# EasyEDA Pro project 蓝牙歌词音箱.epro, schematic Schematic1
Create Date: 2023-08-11; Page Name: P1; Project Name: 蓝牙歌词音箱; Schematic Name: Schematic1; Update Date: 2023-09-09; Company: 花栗鼠; Page Size: A3; Version: V1.1
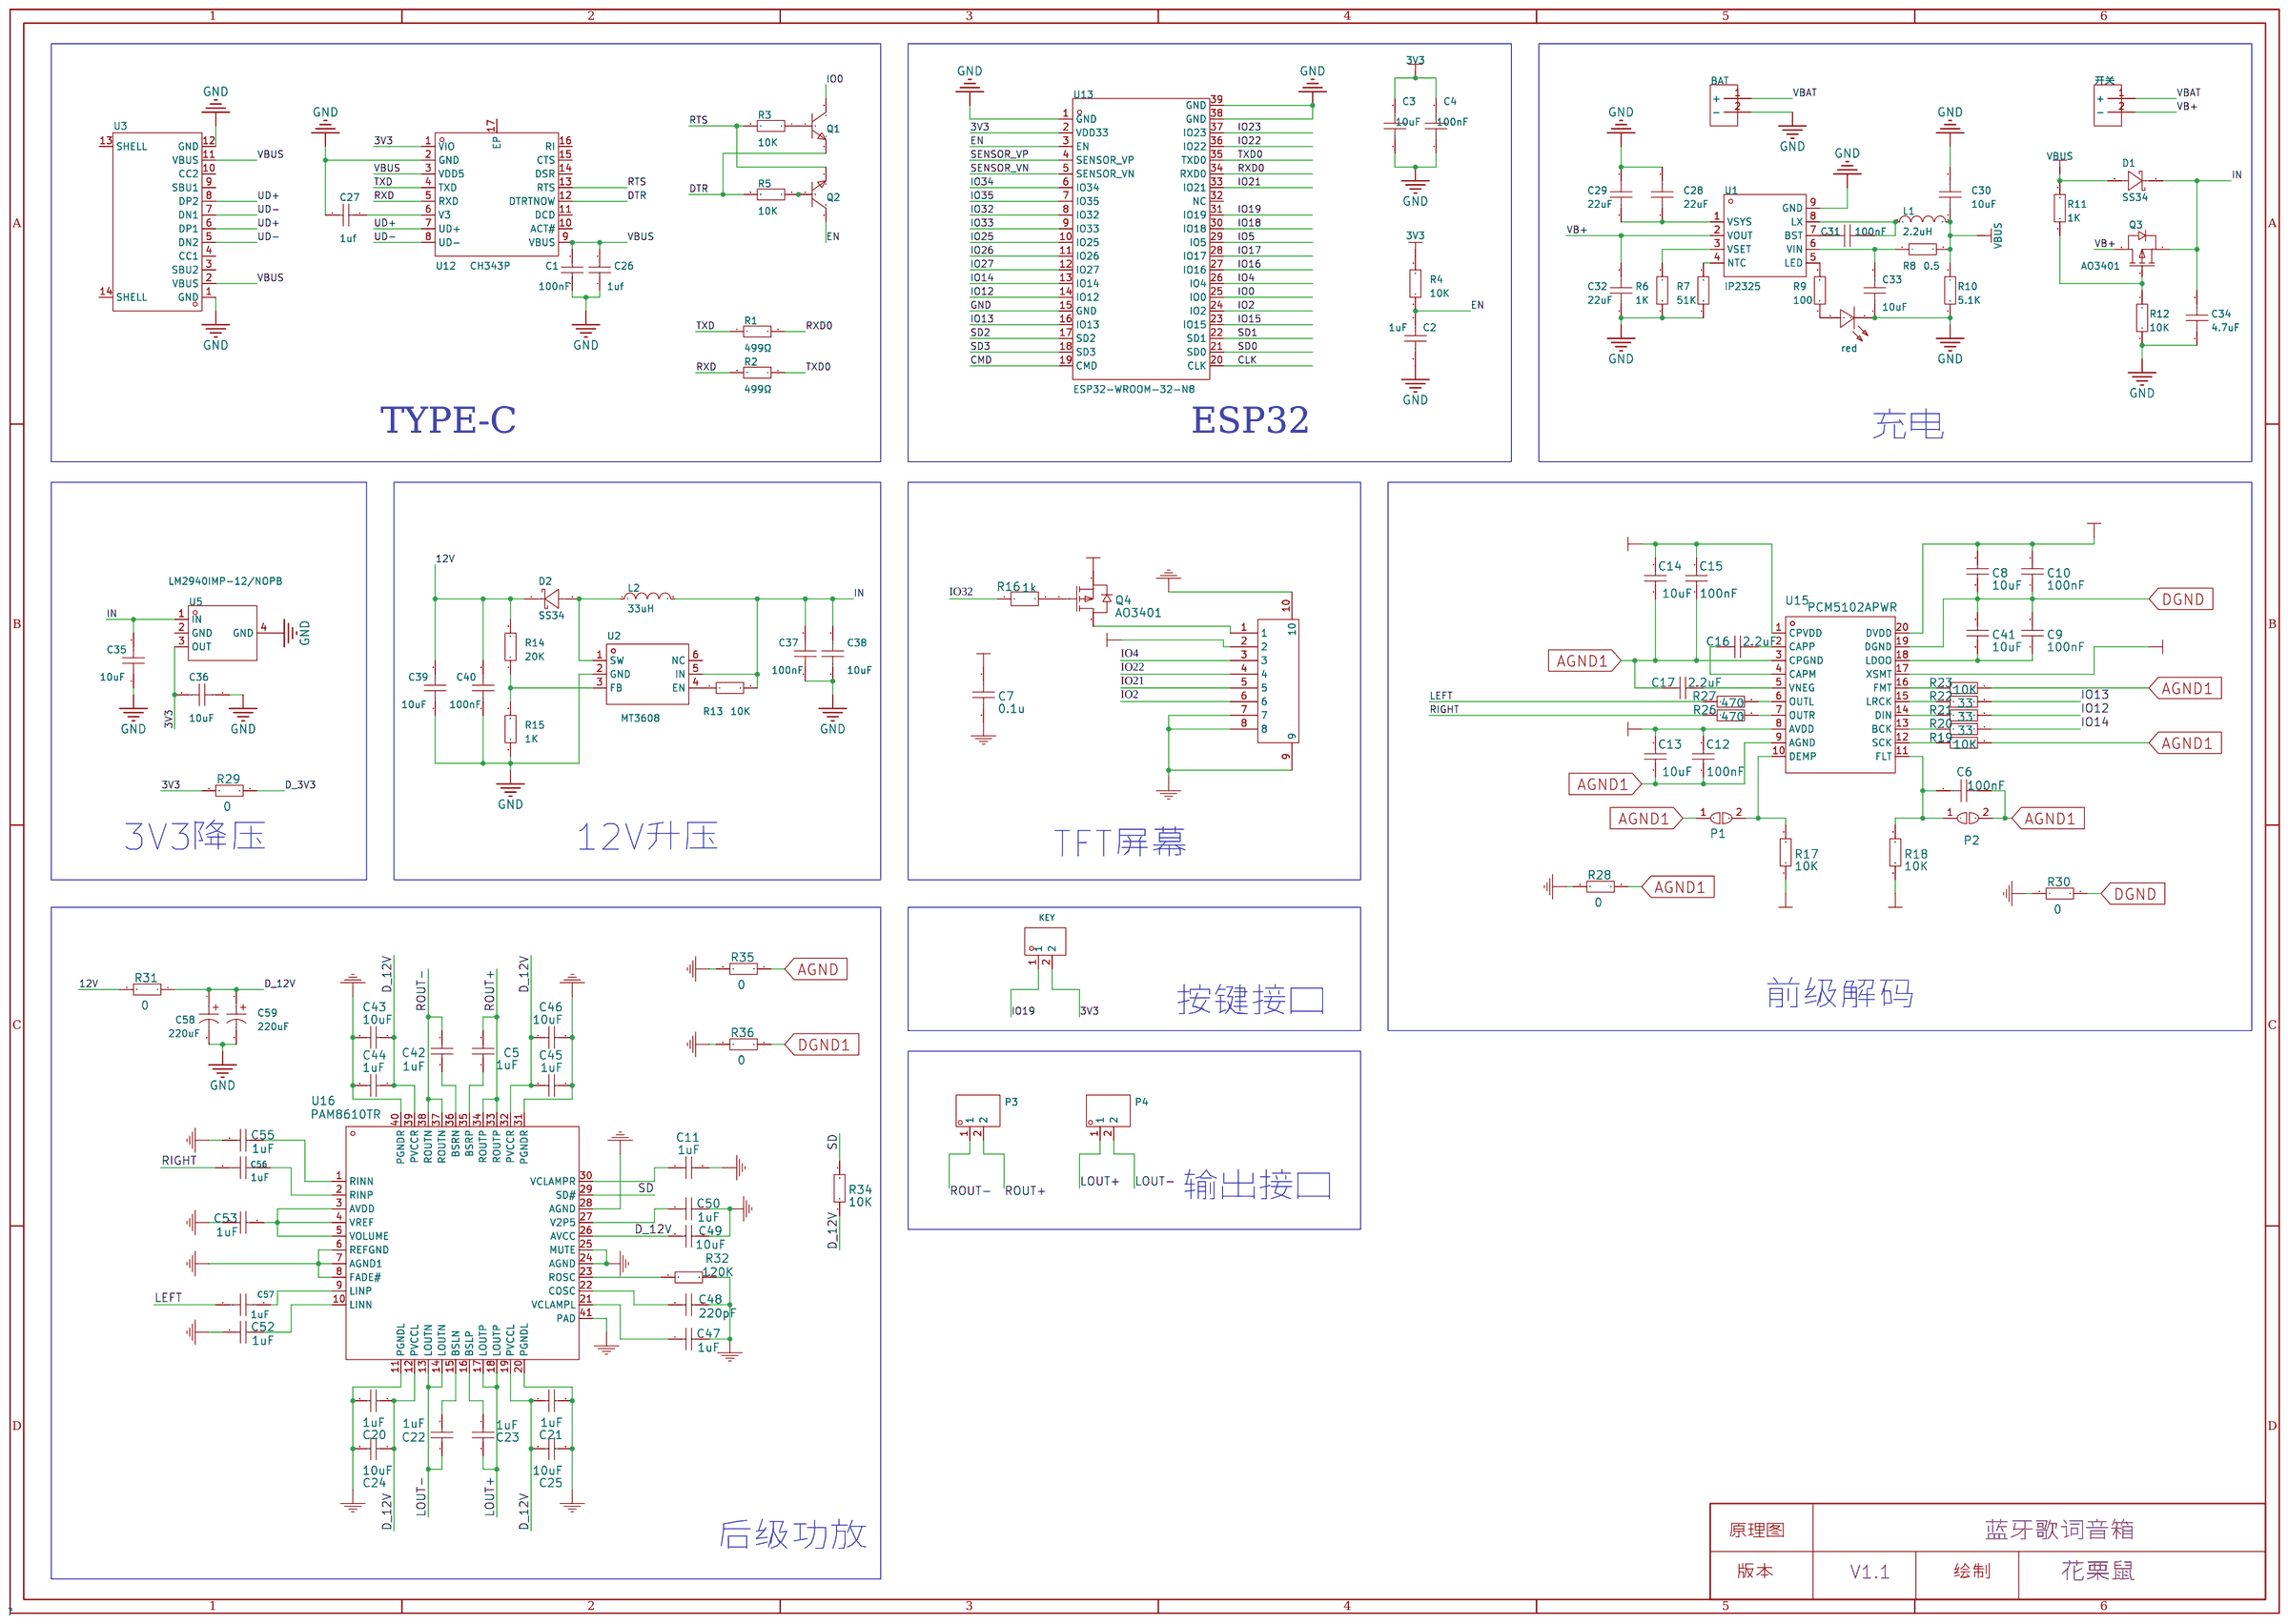
[diagram p1: schematic sheet]

## Parts
BAT  焊盘  [BAT_Plate]
C1  100nF  [C0603]
C2  1uF  [C0603]
C3  10uF  [c0603]
C4  100nF  [c0603]
C5  1uF  [C0603]
C6  100nF  [C0603]
C7  0.1u  [C0603]
C8  10uF  [C0603]
C9  100nF  [C0603]
C10  100nF  [C0603]
C11  1uF  [C0603]
C12  100nF  [C0603]
C13  10uF  [C0603]
C14  10uF  [C0603]
C15  100nF  [C0603]
C16  2.2uF  [C0603]
C17  2.2uF  [C0603]
C20  1uF  [C0603]
C21  1uF  [C0603]
C22  1uF  [C0603]
C23  1uF  [C0603]
C24  10uF  [C0603]
C25  10uF  [C0603]
C26  1uf  [C0603]
C27  1uf  [C0603]
C28  22uF  [C0603]
C29  22uF  [C0603]
C30  10uF  [C0603]
C31  100nF  [C0603]
C32  22uF  [C0603]
C33  10uF  [C0603]
C34  4.7uF  [C0603]
C35  10uF  [C0603]
C36  10uF  [C0603]
C37  100nF  [C0603]
C38  10uF  [C0603]
C39  10uF  [C0603]
C40  100nF  [C0603]
C41  10uF  [C0603]
C42  1uF  [C0603]
C43  10uF  [C0603]
C44  1uF  [C0603]
C45  1uF  [C0603]
C46  10uF  [C0603]
C47  1uF  [C0603]
C48  220pF  [C0603]
C49  10uF  [C0603]
C50  1uF  [C0603]
C52  1uF  [C0603]
C53  1uF  [C0603]
C55  1uF  [C0603]
C56  1uF  [CAP-TH_L7.2-W5.0-P5.00-D1.0]
C57  1uF  [CAP-TH_L7.2-W5.0-P5.00-D1.0]
C58  220uF  [CAP-TH_BD10.0-P5.00-D0.6-FD]
C59  220uF  [CAP-TH_BD10.0-P5.00-D0.6-FD]
D1  SS34  [SMA_L4.3-W2.5-LS5.0-RD]
D2  SS34  [SMA_L4.3-W2.5-LS5.0-RD]
FPC1  AFC01-S08FCA-00  [FPC-SMD_P0.50-8P_FGS-XJ-H2.0]
KEY  PZ254V-11-02P  [HDR-TH_2P-P2.54-V-M]
L1  2.2uH  [IND-SMD_L5.4-W5.2_FXL0530]
L2  33uH  [IND-SMD_L5.4-W5.2_FXL0530]
P1  短接线  [短接焊盘]
P2  短接线  [短接焊盘]
P3  WJ15EDGRC-3.81-2P  [CONN-TH_2P-P3.81_WJ15EDGRC-3.81-2P]
P4  WJ15EDGRC-3.81-2P  [CONN-TH_2P-P3.81_WJ15EDGRC-3.81-2P]
Q1  SS8050-H  [SOT-23-3_L2.9-W1.3-P1.90-LS2.4-BR]
Q2  SS8050-H  [SOT-23-3_L2.9-W1.3-P1.90-LS2.4-BR]
Q3  AO3401  [SOT-23-3_L2.9-W1.4-P1.90-LS2.6-BR]
Q4  AO3401  [AO3401]
R1  499Ω  [r0603]
R2  499Ω  [r0603]
R3  10K  [r0603]
R4  10K  [r0603]
R5  10K  [r0603]
R6  1K  [r0603]
R7  51K  [r0603]
R8  0.5  [r0603]
R9  100  [r0603]
R10  5.1K  [r0603]
R11  1K  [r0603]
R12  10K  [r0603]
R13  10K  [r0603]
R14  20K  [r0603]
R15  1K  [r0603]
R16  1k  [R0603]
R17  10K  [r0603]
R18  10K  [r0603]
R19  10K  [r0603]
R20  33  [r0603]
R21  33  [r0603]
R22  33  [r0603]
R23  10K  [r0603]
R26  470  [r0603]
R27  470  [r0603]
R28  0  [r0603]
R29  0  [r0603]
R30  0  [r0603]
R31  0  [r0603]
R32  120K  [r0603]
R34  10K  [r0603]
R35  0  [r0603]
R36  0  [r0603]
red  正在充电  [LED0603-R-RD_RED]
U1  IP2325  [ESOP-8_L4.9-W3.9-P1.27-LS6.0-BL-EP]
U2  MT3608  [SOT-23-6_L2.9-W1.6-P0.95-LS2.8-BL]
U3  TypeC-16PIN  [USB-C-SMD_TYPE-C-6PIN-2MD-073]
U5  LM2940IMP-12/NOPB  [SOT-223-4_L6.5-W3.5-P2.30-LS7.0-BR]
U12  CH343P  [TQFN-16_L3.0-W3.0-P0.50-BL-EP1.7]
U13  ESP32-WROOM-32-N8  [WIFIM-SMD_39P-L25.5-W18.0-P1.27]
U15  PCM5102APWR  [PCM5102]
U16  PAM8610TR  [WQFN-40_L6.0-W6.0-P0.50-TL-EP]
开关  焊盘  [BAT_Plate]

## Library data of the parts
BAT 开关 = 电池焊盘
C1 C26 C27 = 0603B104K500NT: 容值:100nF;精度:±10%;额定电压:50V;材质(温度系数):X7R;; LCSC Part Name: 100nF ±10% 50V; Supplier Part: C30926; Manufacturer: FH(风华); Supplier Footprint: 0603; JLCPCB Part Class: Extended Part; Datasheet: https://atta.szlcsc.com/upload/public/pdf/source/20170923/C30926_1506149436298988724.pdf; Supplier: LCSC; Tolerance: ±10%; Voltage Rated: 50V; Temperature Coefficient: X7R
C2-C4 = CAP_0805: Supplier Footprint: 0805
C5 C11 C20-C23 C42 C44 C45 C47 C50 C52 C53 C55 = 1uF: Supplier: LCSC; Manufacturer Part: GRM155R61E105KA12D; Manufacturer: MuRata; Supplier Part: C77009
C6 = 100nF: Supplier: LCSC; Supplier Part: C476766; Manufacturer: 火炬; Manufacturer Part: C0805B104K500NT; JLCPCB Part Class: Extended Part
C7 = 0.1u
C8 C13 C14 C41 = 10uF: Supplier: LCSC; Manufacturer: SAMSUNG; Manufacturer Part: CL21A106KAYNNNE; Supplier Part: C15850; JLCPCB Part Class: Basic Part
C9 C10 C12 C15 = 100nF: Supplier: LCSC; Manufacturer Part: 0805B104K500NT; Manufacturer: FH; Supplier Part: C38141; JLCPCB Part Class: Extended Part
C16 C17 = 2.2uF: Supplier: LCSC; Manufacturer: SAMSUNG; Manufacturer Part: CL21A225KAFNNNE; Supplier Part: C87994; JLCPCB Part Class: Extended Part
C24 C25 C43 C46 C49 = 10uF: Supplier: LCSC; Manufacturer Part: CL21A106KAYNNNE; Manufacturer: SAMSUNG; Supplier Part: C15850; JLCPCB Part Class: Basic
C28-C40 = CL10A226MQ8NRNC: 容值:22uF;精度:±20%;额定电压:6.3V;材质(温度系数):X5R;; LCSC Part Name: 22uF ±20% 6.3V; Supplier Part: C59461; Manufacturer: SAMSUNG(三星); Supplier Footprint: 0603; JLCPCB Part Class: 基础库; Datasheet: https://atta.szlcsc.com/upload/public/pdf/source/20160103/1457707740762.pdf; Supplier: LCSC; Tolerance: ±20%; Voltage Rated: 6.3V; Temperature Coefficient: X5R
C48 = 220pF: Supplier: LCSC; Manufacturer: MuRata; Manufacturer Part: GRM155R71H221KA01D; Supplier Part: C97872
C56 C57 = MKS2C041001F00KSSD: 容值:1uF;精度:±10%;额定电压:63V;介电材料:金属化聚酯;; LCSC Part Name: 1uF ±10% 63V; Supplier Part: C126276; Manufacturer: WIMA; Supplier Footprint: 插件,P=5mm; JLCPCB Part Class: 扩展库; Datasheet: https://atta.szlcsc.com/upload/public/pdf/source/20230328/099C5D1A130847A3431CECEC5B712B95.pdf; Supplier: LCSC; Tolerance: ±10%; Voltage Rated: 63V; Dielectric Material: 金属化聚酯; Operating Temperature: -55℃~+125℃
C58 C59 = 35ZLH470M10X16: 容值:470uF;精度:±20%;额定电压:35V;纹波电流:-;等效串联电阻:-;; LCSC Part Name: 470uF ±20% 35V; Supplier Part: C2839464; Manufacturer: rubycon(红宝石); Supplier Footprint: 插件,D10xL16mm; JLCPCB Part Class: 扩展库; Datasheet: https://atta.szlcsc.com/upload/public/pdf/source/20211010/C2839464_09D50EB3F84216F9868C891EBDAB1DC4.pdf; Supplier: LCSC; Tolerance: ±20%; Rated Voltage: 35V; Lead Spacing: 5mm
D1 D2 = SS34_C727060: 二极管配置:独立式;直流反向耐压(Vr):40V;平均整流电流(Io):3A;正向压降(Vf):550mV@3A;; LCSC Part Name: 40V 3A 550mV@3A; Supplier Part: C727060; Manufacturer: TWGMC(台湾迪嘉); Supplier Footprint: SMA; JLCPCB Part Class: 扩展库; Datasheet: https://atta.szlcsc.com/upload/public/pdf/source/20200828/C727059_6599B6CAC5F3238B9C33E46794659DBE.pdf; Supplier: LCSC; Diode Configuration: 独立式; Reverse Voltage (Vr): 40V; Average Rectified Current (Io): 3A; Forward Voltage (Vf@If): 550mV@3A; Reverse Leakage Current (Ir): 500uA@40V
FPC1 = AFC01-S08FCA-00: 间距:0.5mm;触点数量:8P;锁定特性:翻盖式;安装类型:卧贴;触点类型:下接;; LCSC Part Name: 0.5mm P数:8P 翻盖式 下接; Supplier Part: C262657; Manufacturer: JS(钜硕电子); Supplier Footprint: SMD,P=0.5mm; JLCPCB Part Class: 扩展库; Datasheet: https://atta.szlcsc.com/upload/public/pdf/source/20190816/C413942_2A72D1AC756EAE17EEDF756A339D4500.pdf; Supplier: LCSC; Pitch: 0.5mm; Number of Contacts: 8P; Locking Feature: 翻盖式; Mounting Type: 卧贴; Contact Type: 下接; Height Above Board: 2mm; FFC, FCB Thickness: 0.3mm
KEY = PZ254V-11-02P: 排数:单排;总PIN位数:2P;间距:2.54mm;插针结构:1x2P;行距:-;安装类型:直插;圆针/方针:方针;额定电流:-;额定电压:-;配合针长度:6mm;塑高:2.5mm;端接针长度:3mm;触头材质:黄铜;触头镀层:-;工作温度范围:-40℃~+105℃;颜色:黑色;; LCSC Part Name: 2.54mm 1x2P 直插 方针; Supplier Part: C492401; Manufacturer: XFCN(兴飞); Supplier Footprint: 插件,P=2.54mm; JLCPCB Part Class: 扩展库; Datasheet: https://atta.szlcsc.com/upload/public/pdf/source/20200309/C492401_A812433581A9B211A7FFA413ADDFF0E5.pdf; Supplier: LCSC; Number of Rows: 单排; Number of Pins: 2P; Pitch: 2.54mm; Pin Structure: 1x2P; Mounting Type: 直插; Circluar Pins/Square Pins: 方针; Length of Mating Pin: 6mm; Insulation Height: 2.5mm; Length of End Connection Pin: 3mm; Contact Material: 黄铜; Operating Temperature Range: -40℃~+105℃; Color: 黑色
L1 L2 = FXL0530-2R2-M: 电感值:2.2uH;精度:±20%;额定电流:7A;饱和电流(Isat):7.5A;; LCSC Part Name: 2.2uH ±20% 7A 25mΩ; Supplier Part: C177247; Manufacturer: cjiang(长江微电); Supplier Footprint: SMD,5.2x5.4mm; JLCPCB Part Class: 扩展库; Datasheet: https://atta.szlcsc.com/upload/public/pdf/source/20190322/C177247_D673DEF5B71E28EE8B6C692FDFFD2E69.pdf; Supplier: LCSC; Tolerance: ±20%; Rated Current: 7A; Saturation Current (Isat): 7.5A; DC Resistance (DCR): 25mΩ
P1 P2 = 短接线
P3 P4 = WJ15EDGRC-3.81-2P: 连接器类型:板端/插座-闭口;间距:3.81mm;排数:1;每排PIN数:2;安装方式:弯针;颜色:绿色;; LCSC Part Name: 板端/插座-闭口 3.81mm 排数:1 每排P数:2 弯针; Supplier Part: C8387; Manufacturer: KANGNEX(康奈克斯电气); Supplier Footprint: 弯插,P=3.81mm; JLCPCB Part Class: 扩展库; Datasheet: https://atta.szlcsc.com/upload/public/pdf/source/20191225/C8387_8EBAF10345D2762F0167C8753398EEFA.pdf; Supplier: LCSC; Connector Type: 板端/插座-闭口; Pitch: 3.81mm; Number of Rows: 1; Number of PINs Per Row: 2; Mounting Style: 弯针; Color: 绿色
Q1 Q2 = SS8050-H: 晶体管类型:NPN;集射极击穿电压(Vceo):25V;集电极电流(Ic):1.5A;功率(Pd):300mW;集电极截止电流(Icbo):100nA;集电极-发射极饱和电压(VCE(sat)@Ic,Ib):500mV@800mA,80mA;直流电流增益(hFE@Ic,Vce):200@100mA,1V;特征频率(fT):100MHz;工作温度:-55~+150@(Tj);; LCSC Part Name: NPN25V1.5A; Supplier Part: C699255; Manufacturer: YANGJIE(扬杰); Supplier Footprint: SOT-23-3L; JLCPCB Part Class: ExtendedPart; Datasheet: https://atta.szlcsc.com/upload/public/pdf/source/20200709/C699255_98BD284548BE18129453A2CE3A1F2C22.pdf; Supplier: LCSC; Transistor Type: NPN; Collector-Emitter Breakdown Voltage (Vceo): 25V; Collector Current (Ic): 1.5A; Power Dissipation (Pd): 300mW; Collector Cut-Off Current (Icbo): 100nA; Collector-Emitter Saturation Voltage (VCE(sat)@Ic,Ib): 500mV@800mA,80mA; DC Current Gain (hFE@Ic,Vce): 200@100mA,1V; Transition Frequency (fT): 100MHz; Operating Temperature: -55~+150@(Tj)
Q3 = AO3401_C727156: 类型:P沟道;漏源电压(Vdss):30V;连续漏极电流(Id):4.2A;功率(Pd):350mW;导通电阻(RDS(on)@Vgs,Id):65mΩ@10V,4.2A;; LCSC Part Name: P沟道 30V 4.2A; Supplier Part: C727156; Manufacturer: TWGMC(台湾迪嘉); Supplier Footprint: SOT-23; JLCPCB Part Class: 扩展库; Datasheet: https://atta.szlcsc.com/upload/public/pdf/source/20200827/C727156_6E081BBEEFBC6B8FEE164CB196B0AF30.pdf; Supplier: LCSC; Type: P沟道; Drain Source Voltage (Vdss): 30V; Continuous Drain Current (Id): 4.2A; Power Dissipation (Pd): 350mW; Drain Source On Resistance (RDS(on)@Vgs,Id): 65mΩ@10V,4.2A; Gate Threshold Voltage (Vgs(th)@Id): 1.3V@250uA
Q4 = AO3401: Manufacturer: LGE; Supplier: LCSC; Supplier Part: C688915; link: https://item.szlcsc.com/14454.html
R1-R15 = Res_0805: Supplier Footprint: 0805
R16 = 1k
R17-R19 R23 R28-R31 R35 R36 = 10K: Supplier: LCSC; Manufacturer: UniOhm; Manufacturer Part: 0805W8J0103T5E; Supplier Part: C25612; JLCPCB Part Class: Extended Part
R20-R22 = 33: Supplier: LCSC; Manufacturer: UniOhm; Manufacturer Part: 0805W8F330JT5E; Supplier Part: C17634; JLCPCB Part Class: Basic Part
R26 R27 = 470: Supplier: LCSC; Manufacturer: YAGEO; Manufacturer Part: RC0805FR-07470RL; Supplier Part: C114564; JLCPCB Part Class: Extended Part
R32 = 120K: Supplier: LCSC; Manufacturer: WTC; Manufacturer Part: WR04X1203FTL; Supplier Part: C168198
R34 = 10K: Supplier: LCSC; Manufacturer: YAGEO; Manufacturer Part: RC0402FR-0710KL; Supplier Part: C60490
red = NCD0603R3: 尺寸1.6x0.8x0.8；IF=20ma：1.6~2.6v，620~640nm,51~150mcd金线，光强高，功耗低，可靠性好，寿命长; LCSC Part Name: 红色;贴片LED;0603红灯;; Supplier Part: C3151730; Manufacturer: 国星光电; Supplier Footprint: 0603; JLCPCB Part Class: ExtendedPart; Datasheet: https://atta.szlcsc.com/upload/public/pdf/source/20220704/CBFF28C1847A97213A75929E60B7DDE7.pdf; Supplier: LCSC
U1 = IP2325: Supplier Part: C605434; Manufacturer: INJOINIC(英集芯); Supplier Footprint: ESOP-8; JLCPCB Part Class: 扩展库; Datasheet: https://atta.szlcsc.com/upload/public/pdf/source/20200610/C605434_E37CCD504E40C8F43184D4B3B57194A6.pdf; Supplier: LCSC
U2 = MT3608: 功能类型:升压型;输入电压:2V~24V;输出电压:28V;输出电流(最大值):-;; LCSC Part Name: 升压型 输入2V~24V 输出28V; Supplier Part: C84817; Manufacturer: 西安航天民芯; Supplier Footprint: SOT-23-6; JLCPCB Part Class: 扩展库; Datasheet: https://atta.szlcsc.com/upload/public/pdf/source/20161110/1478743351706.pdf; Supplier: LCSC; Function: 升压型; Number of Outputs: 1; Topology: 升压式; Input Voltage: 2V~24V; Output Voltage: 28V; Switching Frequency: 1.2MHz
U3 = TypeC-16PIN: Supplier Part: C9900016187; JLCPCB Part Class: ExtendedPart; Datasheet: https://atta.szlcsc.comnull; Supplier: LCSC
U5 = LM2940IMP-12/NOPB: 输出类型:固定;最大输入电压:26V;输出电流:1A;输出电压（最小值/固定值）:12V;; Supplier Part: C86562; Manufacturer: TI(德州仪器); Supplier Footprint: SOT-223-4; JLCPCB Part Class: Extended Part; Datasheet: https://atta.szlcsc.com/upload/public/pdf/source/20181012/C86562_C13BD1C5565BF5BF0D91488D5322B6E8.pdf; Supplier: LCSC
U12 = CH343P: 类型:-;协议类别:-;驱动器/接收器数:-;数据速率:-;; Supplier Part: C2846043; Manufacturer: WCH(南京沁恒); Supplier Footprint: QFN-16; JLCPCB Part Class: Extended Part; Datasheet: https://atta.szlcsc.com/upload/public/pdf/source/20211010/C2846043_7FA705E1F14A2906F6A2AFA45FA28209.pdf; Supplier: LCSC
U13 = ESP32-WROOM-32-N8: Supplier Part: C529582; Manufacturer: ESPRESSIF(乐鑫); Supplier Footprint: SMD,18x25.5mm; JLCPCB Part Class: 扩展库; Datasheet: https://atta.szlcsc.com/upload/public/pdf/source/20200521/C529581_8F7B9F041ADB7CF235FBC8D159B9C4FF.pdf; Supplier: LCSC
U15 = PCM5102APWR: Supplier: LCSC; Manufacturer: TI; Supplier Part: C107671; JLCPCB Part Class: Extended Part
U16 = PAM8610TR: Supplier: LCSC; Manufacturer: DIODES; Supplier Part: C80797; JLCPCB Part Class: Extend

## Nets
3V3: C3.2 C4.2 C7.1 C12.2 C13.1 C14.1 C15.2 C36.2 FPC1.2 KEY.2 Q4.2(S) R4.2 R17.1 R18.1 R29.2 U5.3(OUT) U12.1(VIO) U13.2(VDD33) U15.1(CPVDD) U15.8(AVDD)
12V: C39.2 C40.2 D2.1(C) R14.2 R31.2
AGND: C11.2 C47.2 C48.2 C49.1 C50.2 C52.1 C53.1 C55.1 R32.2 R35.1 U16.6(REFGND) U16.7(AGND1) U16.8(FADE#) U16.24(AGND) U16.25(MUTE) U16.28(AGND) U16.41(PAD)
AGND1: C6.2 C12.1 C13.2 C14.2 C15.1 C17.1 P1.1 P2.2 R19.2 R23.2 R28.1 U15.3(CPGND) U15.9(AGND)
DGND: C8.2 C9.2 C10.1 C41.1 R30.1 U15.19(DGND)
DGND1: C20.2 C21.2 C24.2 C25.2 C43.2 C44.2 C45.2 C46.2 R36.1 U16.11(PGNDL) U16.20(PGNDL) U16.31(PGNDR) U16.40(PGNDR)
GND: BAT.2(-) C1.1 C2.1 C3.1 C4.1 C7.2 C26.1 C27.2 C28.2 C29.2 C30.2 C32.1 C33.1 C34.1 C35.1 C36.1 C37.1 C38.1 C39.1 C40.1 C58.2 C59.2 FPC1.7 FPC1.8 FPC1.9 FPC1.10 R6.2 R7.2 R10.2 R12.2 R15.1 R28.2 R30.2 R35.2 R36.2 red.2(K) U1.9(GND) U2.2(GND) U3.1(GND) U3.12(GND) U5.4(GND) U12.2(GND) U13.1(GND) U13.15(GND) U13.38(GND) U13.39(GND)
VBAT: BAT.1(+) 开关.1(+)
VBUS: C1.2 C26.2 C30.1 D1.2(A) L1.2 R8.2 R10.1 R11.1 U3.2(VBUS) U3.11(VBUS) U12.3(VDD5) U12.9(VBUS)
CLK: U13.20(CLK)
CMD: U13.19(CMD)
D_3V3: C8.1 C10.2 R29.1 U15.17(XSMT) U15.20(DVDD)
D_12V: C20.1 C21.1 C24.1 C25.1 C43.1 C44.1 C45.1 C46.1 C49.2 C58.1 C59.1 R31.1 R34.2 U16.12(PVCCL) U16.19(PVCCL) U16.26(AVCC) U16.32(PVCCR) U16.39(PVCCR)
DTR: Q1.2(E) R5.2 U12.12(DTRTNOW)
EN: C2.2 Q2.3(C) R4.1 U13.3(EN)
IN: C34.2 C35.2 C37.2 C38.2 D1.1(C) L2.2 Q3.2(S) R13.2 U2.5(IN) U5.1(IN)
IO0: Q1.3(C) U13.25(IO0)
IO2: FPC1.6 U13.24(IO2)
IO4: FPC1.3 U13.26(IO4)
IO5: U13.29(IO5)
IO12: R21.2 U13.14(IO12)
IO13: R22.2 U13.16(IO13)
IO14: R20.2 U13.13(IO14)
IO15: U13.23(IO15)
IO16: U13.27(IO16)
IO17: U13.28(IO17)
IO18: U13.30(IO18)
IO19: KEY.1 U13.31(IO19)
IO21: FPC1.5 U13.33(IO21)
IO22: FPC1.4 U13.36(IO22)
IO23: U13.37(IO23)
IO25: U13.10(IO25)
IO26: U13.11(IO26)
IO27: U13.12(IO27)
IO32: R16.1 U13.8(IO32)
IO33: U13.9(IO33)
IO34: U13.6(IO34)
IO35: U13.7(IO35)
LEFT: C57.2 R27.1
LOUT+: C23.2 P4.1 U16.17(LOUTP) U16.18(LOUTP)
LOUT-: C22.1 P4.2 U16.13(LOUTN) U16.14(LOUTN)
RIGHT: C56.2 R26.1
ROUT+: C5.2 P3.2 U16.33(ROUTP) U16.34(ROUTP)
ROUT-: C42.1 P3.1 U16.37(ROUTN) U16.38(ROUTN)
RTS: Q2.2(E) R3.2 U12.13(RTS)
RXD: R2.2 U12.5(RXD)
RXD0: R1.2 U13.34(RXD0)
SD: R34.1 U16.29(SD#)
SD0: U13.21(SD0)
SD1: U13.22(SD1)
SD2: U13.17(SD2)
SD3: U13.18(SD3)
SENSOR_VN: U13.5(SENSOR_VN)
SENSOR_VP: U13.4(SENSOR_VP)
TXD: R1.1 U12.4(TXD)
TXD0: R2.1 U13.35(TXD0)
UD+: U3.6(DP1) U3.8(DP2) U12.7(UD+)
UD-: U3.5(DN2) U3.7(DN1) U12.8(UD-)
VB+: C32.2 Q3.3(D) U1.2(VOUT) 开关.2(-)
$1N862: Q2.1(B) R5.1
$1N865: Q1.1(B) R3.1
$1N882: C27.1 U12.6(V3)
$1N1397: C28.1 C29.1 U1.1(VSYS)
$1N1597: C31.2 U1.7(BST)
$1N1601: C31.1 L1.1 U1.8(LX)
$1N1725: R7.1 U1.4(NTC)
$1N1732: R6.1 U1.3(VSET)
$1N1898: R9.2 U1.5(LED)
$1N1964: R9.1 red.1(A)
$1N1970: C33.2 R8.1 U1.6(VIN)
$1N2379: Q3.1(G) R11.2 R12.1
$1N2760: R13.1 U2.4(EN)
$1N3009: D2.2(A) L2.1 U2.1(SW)
$1N3017: R14.1 R15.2 U2.3(FB)
$1N3399: FPC1.1 Q4.3(D)
$1N3414: Q4.1(G) R16.2
$1N5462: P1.2 R17.2 U15.10(DEMP)
$1N5466: C6.1 P2.1 R18.2 U15.11(FLT)
$1N5468: R19.1 U15.12(SCK)
$1N5470: R22.1 U15.15(LRCK)
$1N5471: R21.1 U15.14(DIN)
$1N5472: R20.1 U15.13(BCK)
$1N5473: R23.1 U15.16(FMT)
$1N5483: C9.1 C41.2 U15.18(LDOO)
$1N5488: R27.2 U15.6(OUTL)
$1N5489: R26.2 U15.7(OUTR)
$1N5494: C16.2 U15.2(CAPP)
$1N5495: C16.1 U15.4(CAPM)
$1N5496: C17.2 U15.5(VNEG)
$1N6728: C42.2 U16.36(BSRN)
$1N6729: C5.1 U16.35(BSRP)
$1N6742: C23.1 U16.16(BSLP)
$1N6743: C22.2 U16.15(BSLN)
$1N6748: C47.1 U16.21(VCLAMPL)
$1N6750: R32.1 U16.23(ROSC)
$1N6751: C48.1 U16.22(COSC)
$1N6756: C50.1 U16.27(V2P5)
$1N6760: C11.1 U16.30(VCLAMPR)
$1N6762: C52.2 U16.10(LINN)
$1N6763: C57.1 U16.9(LINP)
$1N6766: C56.1 U16.2(RINP)
$1N6767: C55.2 U16.1(RINN)
$1N8767: C53.2 U16.3(AVDD) U16.4(VREF) U16.5(VOLUME)

Not connected (* = marked no-connect by the designer): U2 6(NC); U3 3(SBU2) 4(CC1) 9(SBU1) 10(CC2) 13(SHELL) 14(SHELL); U5 2(GND); U12 10(ACT#) 11(DCD) 14(DSR) 15(CTS) 16(RI) 17(EP); U13 32(NC)

## Notes on the sheet
- TYPE-C
- ESP32
- 充电
- 3V3降压
- 12V升压
- TFT屏幕
- 按键接口
- 前级解码
- 输出接口
- 后级功放
